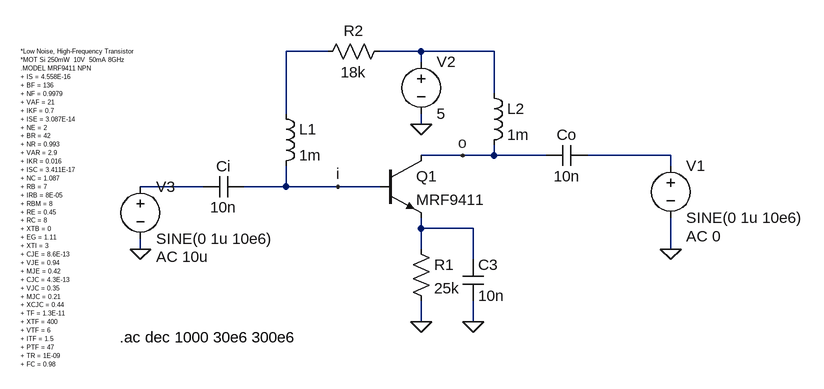
[diagram p0: schematic MRF9411_AC.asc]
MRF9411_AC.asc, the LTspice schematic file:
Version 4
SHEET 1 880 680
WIRE -80 -96 -144 -96
WIRE 64 -96 0 -96
WIRE 176 -96 64 -96
WIRE 64 -80 64 -96
WIRE 176 -32 176 -96
WIRE -144 0 -144 -96
WIRE 64 16 64 0
WIRE 128 64 64 64
WIRE 176 64 176 48
WIRE 176 64 128 64
WIRE 256 64 176 64
WIRE 448 64 320 64
WIRE 448 80 448 64
WIRE -272 112 -368 112
WIRE -144 112 -144 80
WIRE -144 112 -208 112
WIRE -64 112 -144 112
WIRE 0 112 -64 112
WIRE 64 176 64 160
WIRE 144 176 64 176
WIRE -368 208 -368 192
WIRE 64 208 64 176
WIRE 448 208 448 160
WIRE 144 224 144 176
WIRE 64 320 64 288
WIRE 144 320 144 288
FLAG 64 16 0
FLAG -368 208 0
FLAG 448 208 0
FLAG 64 320 0
FLAG 144 320 0
FLAG -64 112 i
FLAG 128 64 o
SYMBOL npn 0 64 R0
SYMATTR InstName Q1
SYMATTR Value MRF9411
SYMBOL ind -160 -16 R0
SYMATTR InstName L1
SYMATTR Value 1m
SYMBOL ind 160 -48 R0
SYMATTR InstName L2
SYMATTR Value 1m
SYMBOL cap 320 48 R90
WINDOW 0 0 32 VBottom 2
WINDOW 3 32 32 VTop 2
SYMATTR InstName Co
SYMATTR Value 10n
SYMBOL cap -272 128 R270
WINDOW 0 32 32 VTop 2
WINDOW 3 0 32 VBottom 2
SYMATTR InstName Ci
SYMATTR Value 10n
SYMBOL voltage 64 -96 R0
SYMATTR InstName V2
SYMATTR Value 5
SYMBOL voltage -368 96 R0
WINDOW 123 24 124 Left 2
WINDOW 39 0 0 Left 0
SYMATTR Value2 AC 10u
SYMATTR InstName V3
SYMATTR Value SINE(0 1u 10e6)
SYMBOL res 48 192 R0
SYMATTR InstName R1
SYMATTR Value 25k
SYMBOL cap 128 224 R0
SYMATTR InstName C3
SYMATTR Value 10n
SYMBOL res 16 -112 R90
WINDOW 0 0 56 VBottom 2
WINDOW 3 32 56 VTop 2
SYMATTR InstName R2
SYMATTR Value 18k
SYMBOL voltage 448 64 R0
WINDOW 123 24 124 Left 2
WINDOW 39 0 0 Left 0
SYMATTR Value2 AC 0
SYMATTR InstName V1
SYMATTR Value SINE(0 1u 10e6)
TEXT -400 344 Left 2 !.ac dec 1000 30e6 300e6
TEXT -552 -96 Left 0 !*Low Noise, High-Frequency Transistor\n*MOT Si 250mW  10V  50mA 8GHz \n.MODEL MRF9411 NPN \n+ IS = 4.558E-16 \n+ BF = 136 \n+ NF = 0.9979 \n+ VAF = 21 \n+ IKF = 0.7 \n+ ISE = 3.087E-14 \n+ NE = 2 \n+ BR = 42 \n+ NR = 0.993 \n+ VAR = 2.9 \n+ IKR = 0.016 \n+ ISC = 3.411E-17 \n+ NC = 1.087 \n+ RB = 7 \n+ IRB = 8E-05 \n+ RBM = 8 \n+ RE = 0.45 \n+ RC = 8 \n+ XTB = 0 \n+ EG = 1.11 \n+ XTI = 3 \n+ CJE = 8.6E-13 \n+ VJE = 0.94 \n+ MJE = 0.42 \n+ CJC = 4.3E-13 \n+ VJC = 0.35 \n+ MJC = 0.21 \n+ XCJC = 0.44 \n+ TF = 1.3E-11 \n+ XTF = 400 \n+ VTF = 6 \n+ ITF = 1.5 \n+ PTF = 47 \n+ TR = 1E-09 \n+ FC = 0.98

The netlist it stands for:
* MRF9411_AC.asc
Q1 o i N005 0 MRF9411
L1 N001 i 1m
L2 N002 o 1m
Co N003 o 10n
Ci N004 i 10n
V2 N002 0 5
V3 N004 0 SINE(0 1u 10e6) AC 10u
R1 N005 0 25k
C3 N005 0 10n
R2 N002 N001 18k
V1 N003 0 SINE(0 1u 10e6) AC 0
.model NPN NPN
.model PNP PNP
.lib standard.bjt
.ac dec 1000 30e6 300e6
*Low Noise, High-Frequency Transistor
*MOT Si 250mW  10V  50mA 8GHz
.MODEL MRF9411 NPN
+ IS = 4.558E-16
+ BF = 136
+ NF = 0.9979
+ VAF = 21
+ IKF = 0.7
+ ISE = 3.087E-14
+ NE = 2
+ BR = 42
+ NR = 0.993
+ VAR = 2.9
+ IKR = 0.016
+ ISC = 3.411E-17
+ NC = 1.087
+ RB = 7
+ IRB = 8E-05
+ RBM = 8
+ RE = 0.45
+ RC = 8
+ XTB = 0
+ EG = 1.11
+ XTI = 3
+ CJE = 8.6E-13
+ VJE = 0.94
+ MJE = 0.42
+ CJC = 4.3E-13
+ VJC = 0.35
+ MJC = 0.21
+ XCJC = 0.44
+ TF = 1.3E-11
+ XTF = 400
+ VTF = 6
+ ITF = 1.5
+ PTF = 47
+ TR = 1E-09
+ FC = 0.98
.backanno
.end